# Altium schematic sheet BlueTooth.SchDoc
size A4; PageSetup: Record=PageOptions|CenterHorizontal=True|CenterVertical=True|PrintScale=0.97|XCorrection=1.00|YCorrection=1.00|PrintKind=2|BorderSize=5000000|LeftOffset=0|BottomOffset=0|Orientation=2|PaperLength=1000|PaperWidth=1000|Scale=100|PaperSource=7|PrintQuality=-3|MediaType=1|DitherType=10|PrintScaleMode=1|PaperKind=A4|PaperIndex=9
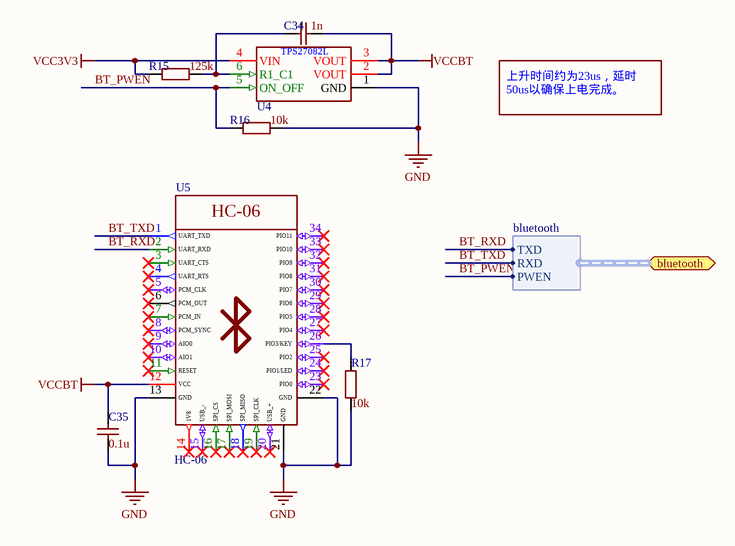
[diagram p0: BlueTooth.SchDoc]

## Parts
C34  value 1n  [C0402_h]  (hidden comment: Capacitor)
C35  value 0.1u  [C0402_h]  (hidden comment: Capacitor)
R15  value 125k  [R0402]  (hidden comment: Register)
R16  value 10k  [R0402]  (hidden comment: Register)
R17  value 10k  [R0402]  (hidden comment: Register)
U4  TPS27082L  [SOT23-6]  (value not drawn)
U5  HC-06  [HC-0X-bluetooth]

## Ports
bluetooth (harness bluetooth)

## Harnesses
bluetooth: TXD, RXD, PWEN

## Nets
GND: C35.1 R16.2 R17.1 U4.1(GND) U5.13(GND) U5.21(GND) U5.22(GND)
VCC3V3: R15.1 U4.4(VIN)
VCCBT: C34.2 C35.2 U4.2(VOUT) U4.3(VOUT) U5.12(VCC)
BT_PWEN: R16.1 U4.5(ON_OFF) ; port bluetooth.PWEN
BT_RXD: U5.2(UART_RXD) ; port bluetooth.TXD
BT_TXD: U5.1(UART_TXD) ; port bluetooth.RXD
NetC34_1: C34.1 R15.2 U4.6(R1_C1)
NetR17_2: R17.2 U5.26(PIO3/KEY)

Not connected (* = marked no-connect by the designer): U5 3(UART_CTS)* 4(UART_RTS)* 5(PCM_CLK)* 6(PCM_OUT)* 7(PCM_IN)* 8(PCM_SYNC)* 9(AIO0)* 10(AIO1)* 11(RESET)* 14(1V8)* 15(USB_-)* 16(SPI_CS)* 17(SPI_MOSI)* 18(SPI_MISO)* 19(SPI_CLK)* 20(USB_+)* 23(PIO0)* 24(PIO1/LED)* 25(PIO2)* 27(PIO4)* 28(PIO5)* 29(PIO6)* 30(PIO7)* 31(PIO8)* 32(PIO9)* 33(PIO10)* 34(PIO11)*

## Notes on the sheet
- 上升时间约为23us，延时50us以确保上电完成。

## Library data of the parts
C34 C35 = 贴片电容-无极性: VDC: 10V; Published: 8-Jun-2000; LatestRevisionDate: 17-Jul-2002; LatestRevisionNote: Re-released for DXP Platform.; PackageReference: RAD-0.3; Publisher: Altium Limited; PackageDescription: Radial Cap, Thru-Hole; 2 Leads; 0.3 in Pin Spacing
R15-R17 = 贴片电阻
U4 = TPS27082LDDCR: load switch; Manufacturer: Texas Instruments; CompType: IC; PIN_COUNT: 6; PartNumber: TPS27082LDDC; PackageReference: DDC0006A; MountType: SMT; RoHS: Y; RefDes: RefDes; Type: DEV; Value: Value
U5 = HC-06 Bluetooth